# Altium schematic sheet illuminated_button.SchDoc
size A4
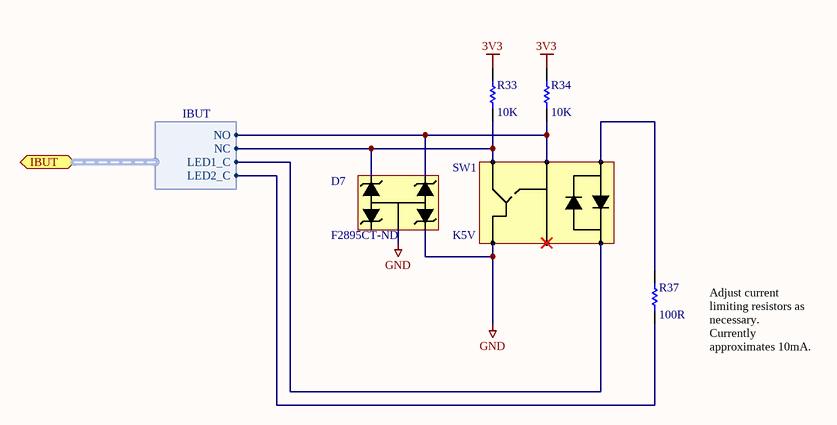
[diagram p0: illuminated_button.SchDoc]

## Parts
D7  Supplier Part Number 1: F2895CT-ND  [SC70-5]  (hidden comment: SP1001-04)
R33  value 10K  [0603]
R34  value 10K  [0603]
R37  value 100R  [0603]
SW1  K5V  [K5V_PM]

## Ports
IBUT (harness IBUT)

## Harnesses
IBUT: NC, NO, LED1_C, LED2_C

## Nets
3V3: R33.2 R34.2
GND: D7.2 D7.3 SW1.2
NetD7_4: D7.4 R34.1 SW1.3 ; port IBUT.NO
NetD7_5: D7.5 R33.1 SW1.1 ; port IBUT.NC
NetR37_1: R37.1 ; port IBUT.LED2_C
NetR37_2: R37.2 SW1.5
NetSW1_6: SW1.6 ; port IBUT.LED1_C

Not connected (* = marked no-connect by the designer): D7 1; SW1 4*

## Notes on the sheet
- Adjust current limiting resistors as necessary.
  Currently approximates 10mA.

## Library data of the parts
D7 = SP1001-04: 8pF 15kV Unidirectional TVS Array 0.5uA@5.5V; Manufacturer: Littelfuse Inc; Manufacturer Part Number: SP1001-04JTG; Description: TVS ARRAY ESD SIL 4CH SC70-5; Voltage - Reverse Standoff (Typ): 5.5V; Voltage - Breakdown: 6V; Polarization: 4 Channel Array - Unidirectional; Supplier 1: Digi-Key; RoHS: RoHS Compliant; Category: Circuit Protection; Stock 1: 3207; Pricing 1: 1=0.71, 10=0.594, 25=0.5208, 100=0.4456, 250=0.38648, 500=0.32736, 1000=0.25238 (AUD); Packaging: Cut Tape (CT); Power (Watts): -; Mounting Type: Surface Mount; Package / Case: 6-TSSOP (5 Lead), SC-88A, SOT-353; Supplier Device Package: SC-70-5; ComponentLink1URL: http://www.littelfuse.com/~/media/Files/Littelfuse/Technical%20Resources/Documents/Data%20Sheets/Littelfuse_TVS_Diode_Array_SP1001_Datasheet.pdf; ComponentLink1Description: http://www.littelfuse.com/~/media/Files/Littelfuse/Technical%20Resources/Documents/Data%20Sheets/Littelfuse_TVS_Diode_Array_SP1001_Datasheet.pdf
R33 R34 = Res Semi: Semiconductor Resistor; Manufacturer: TE Connectivity; Manufacturer Part Number: 1622829-1; Description: RES 10.0K OHM 1/10W 1% 0603; Power (Watts): 0.1W, 1/10W; Temperature Coefficient: ±100ppm/°C; Tolerance: ±1%; Published: 8-Jun-2000; LatestRevisionDate: 17-Jul-2002; LatestRevisionNote: Re-released for DXP Platform.; PackageReference: AXIAL-0.5; Publisher: Altium Limited; PackageDescription: Axial Device, Thru-Hole; 2 Leads; 0.5 in Pin Spacing; Supplier 1: Digi-Key; Supplier Part Number 1: A106048CT-ND; RoHS: RoHS Compliant; Category: Resistors; Stock 1: 36711; Pricing 1: 1=0.12, 10=0.02, 25=0.0148, 50=0.0116, 100=0.0085, 250=0.00648, 500=0.0052, 1000=0.00382, 2500=0.00331 (AUD); Packaging: Cut Tape (CT); Resistance (Ohms): 10k; Composition: Thick Film; Features: -; Package / Case: 0603 (1608 Metric); Supplier Device Package: 0603; Size / Dimension: 0.063" L x 0.031" W (1.60mm x 0.80mm); Height: 0.022" (0.55mm); Number of Terminations: 2; ComponentLink1URL: http://www.te.com/commerce/DocumentDelivery/DDEController?Action=srchrtrv&DocNm=1622829&DocType=Customer+Drawing&DocLang=English; ComponentLink1Description: http://www.te.com/commerce/DocumentDelivery/DDEController?Action=srchrtrv&DocNm=1622829&DocType=Customer+Drawing&DocLang=English
R37 = Res Semi: Semiconductor Resistor; Manufacturer: Panasonic Electronic Components; Manufacturer Part Number: ERJ-3EKF1000V; Description: RES 100 OHM 1/10W 1% 0603 SMD; Resistance (Ohms): 100; Power (Watts): 0.1W, 1/10W; Temperature Coefficient: ±100ppm/°C; Tolerance: ±1%; Published: 8-Jun-2000; LatestRevisionDate: 17-Jul-2002; LatestRevisionNote: Re-released for DXP Platform.; PackageReference: AXIAL-0.5; Publisher: Altium Limited; PackageDescription: Axial Device, Thru-Hole; 2 Leads; 0.5 in Pin Spacing; Supplier 1: Digi-Key; Supplier Part Number 1: P100HCT-ND; RoHS: RoHS Compliant; Category: Resistors; Stock 1: 1636355; Pricing 1: 1=0.12, 50=0.0166, 100=0.0126, 250=0.00936, 500=0.00692, 1000=0.00461 (AUD); Packaging: Cut Tape (CT); Composition: Thick Film; Features: -; Package / Case: 0603 (1608 Metric); Supplier Device Package: 0603; Size / Dimension: 0.063" L x 0.031" W (1.60mm x 0.80mm); Height: 0.022" (0.55mm); Number of Terminations: 2; ComponentLink1URL: http://industrial.panasonic.com/www-cgi/jvcr13pz.cgi?E+PZ+3+AOA0002+ERJ3EKF1000V+7+WW; ComponentLink1Description: http://industrial.panasonic.com/www-cgi/jvcr13pz.cgi?E+PZ+3+AOA0002+ERJ3EKF1000V+7+WW
SW1 = K5V: K5V Illuminated Tactile Switch